# Altium schematic sheet Mecabot_schematic.SchDoc
size A3; SheetNumber: 1; SheetTotal: 1
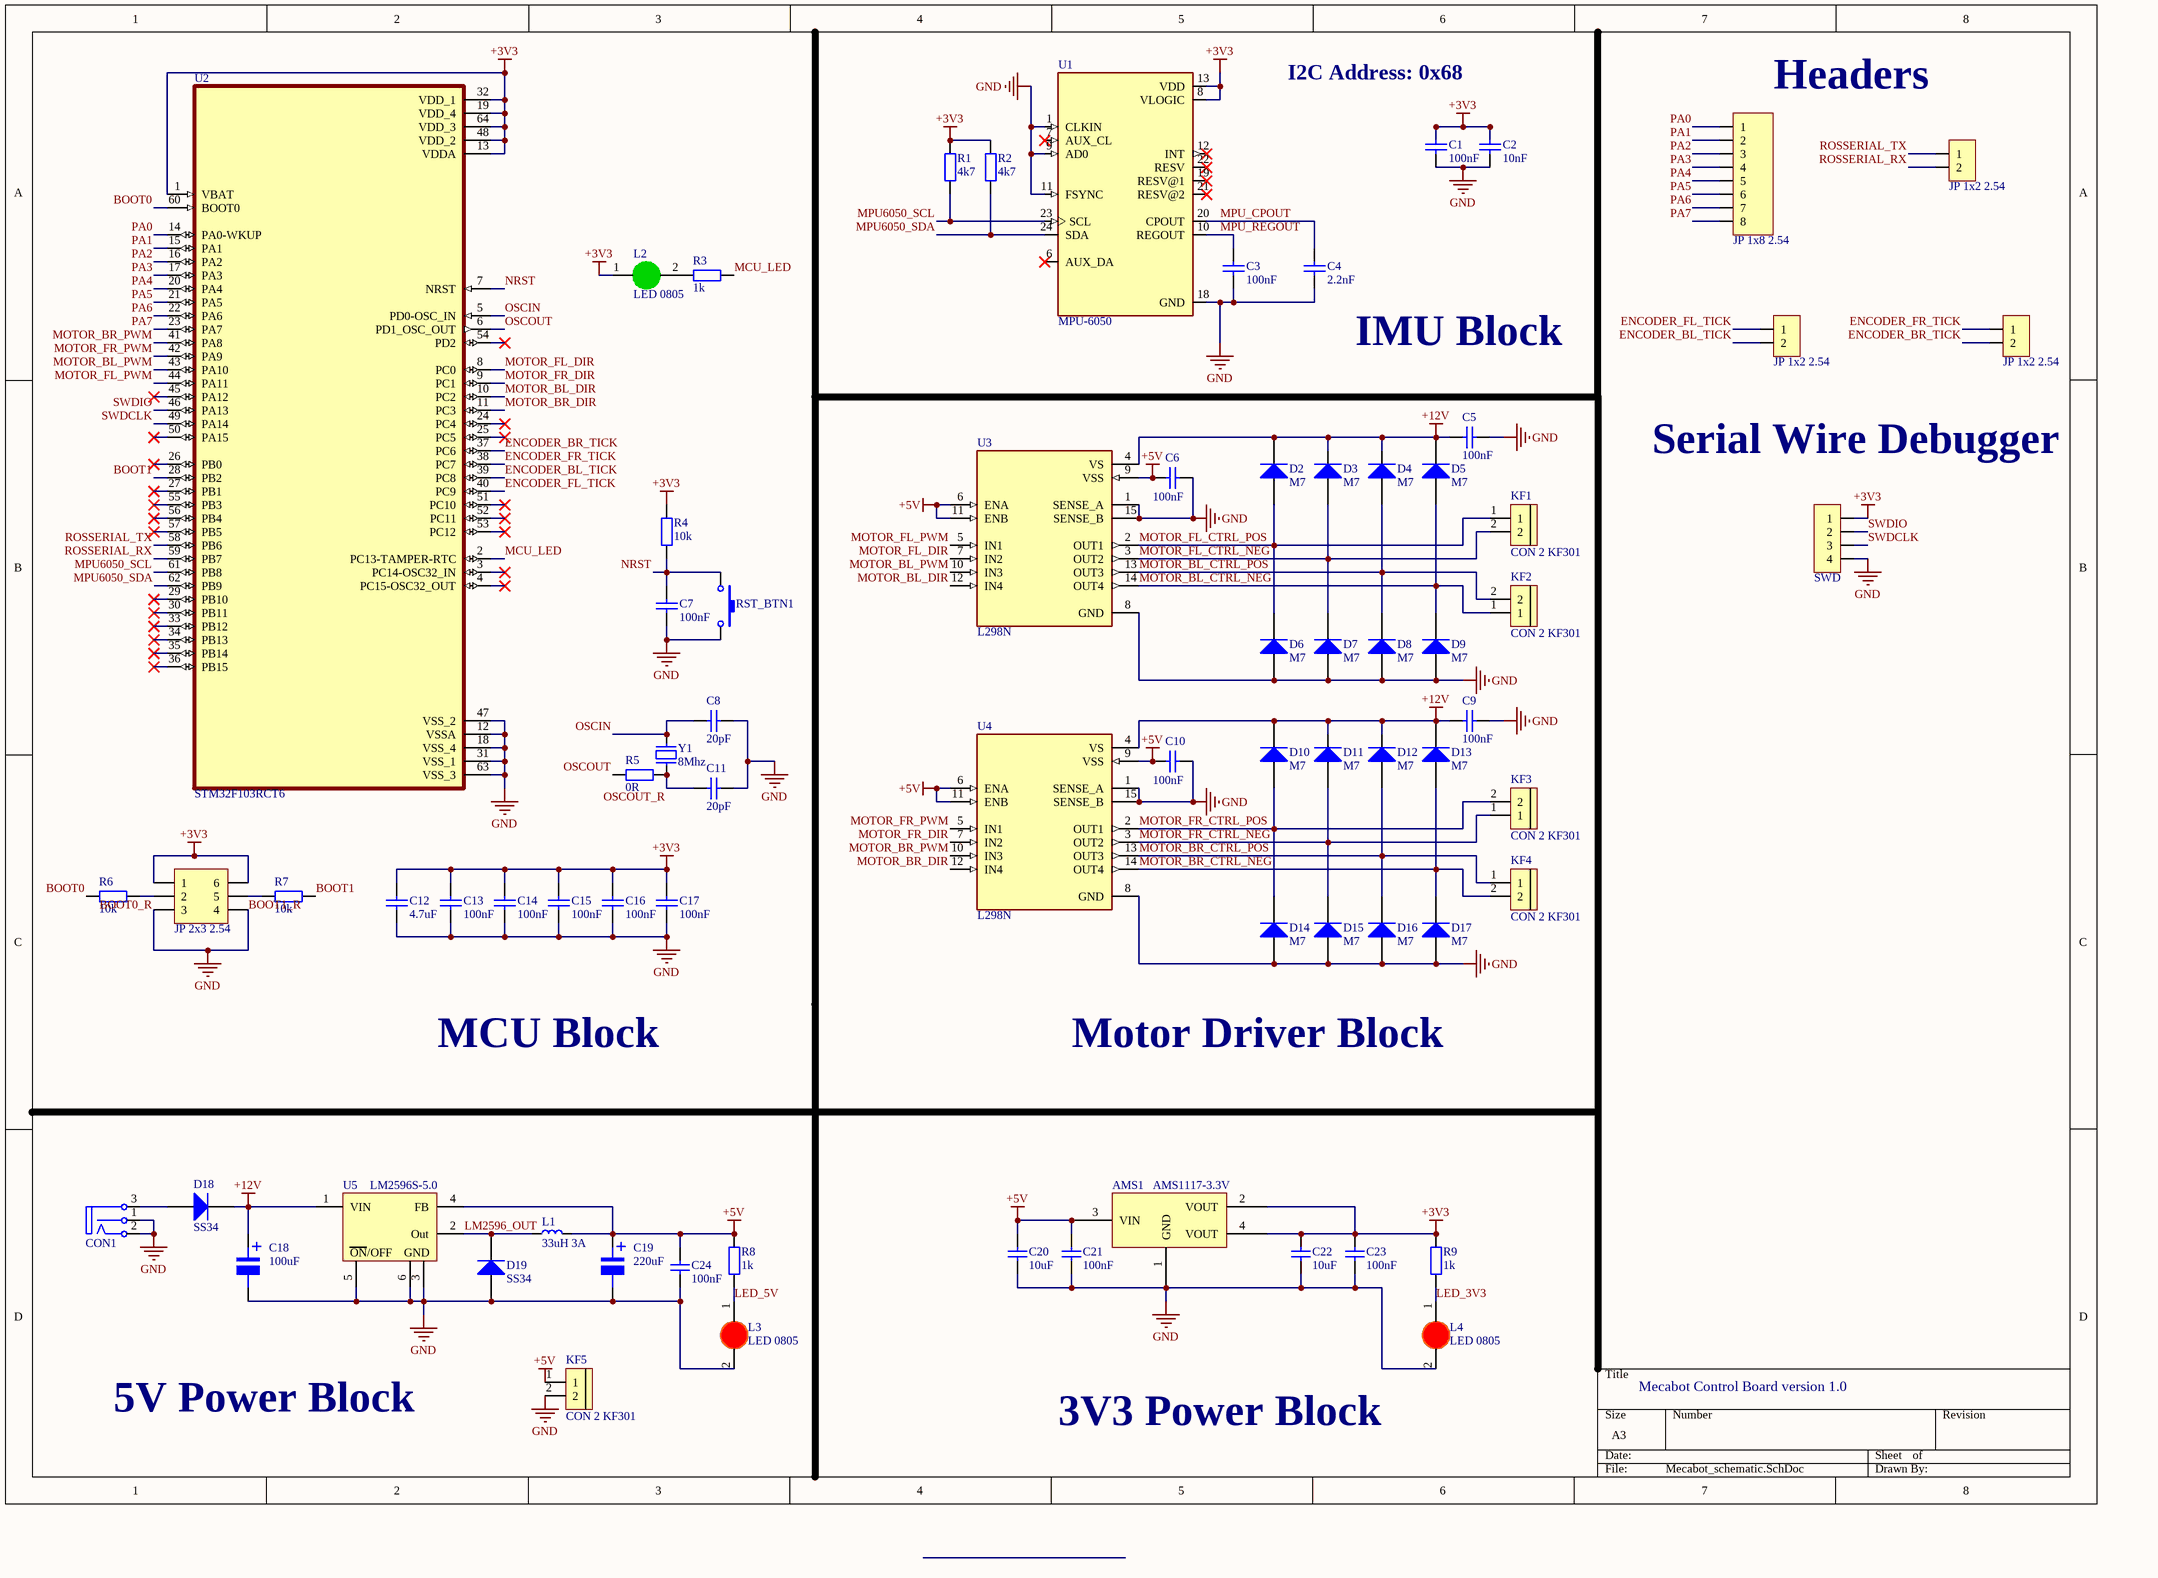
[diagram p0: Mecabot_schematic.SchDoc]

## Parts
AMS1  AMS1117-3.3V  [SOT223]
C1  100nF  [tu 0603]
C2  10nF  [tu 0603]
C3  100nF  [tu 0603]
C4  2.2nF  [tu 0603]
C5  100nF  [tu 0603]
C6  100nF  [tu 0603]
C7  100nF  [tu 0603]
C8  20pF  [tu 0603]
C9  100nF  [tu 0603]
C10  100nF  [tu 0603]
C11  20pF  [tu 0603]
C12  4.7uF  [tu 0805]
C13  100nF  [tu 0603]
C14  100nF  [tu 0603]
C15  100nF  [tu 0603]
C16  100nF  [tu 0603]
C17  100nF  [tu 0603]
C18  100uF  [tu nhom 8 (f)]
C19  220uF  [tu nhom 8 (f)]
C20  10uF  [C 0603]
C21  100nF  [C 0603]
C22  10uF  [C 0603]
C23  100nF  [C 0603]
C24  100nF  [C 0603]
CON1  CON DC PWR  [CONN/DC/PWR/5.0MM]  (value not drawn)
D2  M7  [DIODE SMA]
D3  M7  [DIODE SMA]
D4  M7  [DIODE SMA]
D5  M7  [DIODE SMA]
D6  M7  [DIODE SMA]
D7  M7  [DIODE SMA]
D8  M7  [DIODE SMA]
D9  M7  [DIODE SMA]
D10  M7  [DIODE SMA]
D11  M7  [DIODE SMA]
D12  M7  [DIODE SMA]
D13  M7  [DIODE SMA]
D14  M7  [DIODE SMA]
D15  M7  [DIODE SMA]
D16  M7  [DIODE SMA]
D17  M7  [DIODE SMA]
D18  SS34  [DIODE SMA]
D19  SS34  [DIODE SMA]
JP1  JP 1x8 2.54  [JP 1x8 CT]
JP2  JP 1x2 2.54  [JP 1x2 DC]
JP3  JP 1x2 2.54  [JP 1x2 DT]
JP4  JP 1x2 2.54  [JP 1x2 DT]
JP5  SWD  [JP 1x4 DC]
JP6  JP 2x3 2.54  [JP 2x3 DT]
KF1  CON 2 KF301  [Con 2 KF301 5.08]
KF2  CON 2 KF301  [Con 2 KF301 5.08]
KF3  CON 2 KF301  [Con 2 KF301 5.08]
KF4  CON 2 KF301  [Con 2 KF301 5.08]
KF5  CON 2 KF301  [Con 2 KF301 5.08]
L1  33uH 3A  [Inductor SMD 12x12x8]
L2  LED 0805  [LED-1206-Green]
L3  LED 0805  [LED-1206-Red]
L4  LED 0805  [LED-1206-Red]
R1  4k7  [tro smd 0603]
R2  4k7  [tro smd 0603]
R3  1k  [tro smd 0603]
R4  10k  [tro smd 0603]
R5  0R  [tro smd 0603]
R6  10k  [tro smd 0603]
R7  10k  [tro smd 0603]
R8  1k  [tro smd 0603]
R9  1k  [tro smd 0603]
RST_BTN1  Nut Nhan 2 Chan SMD 3x6x2.5  [Nut Nhan 2 Chan SMD 3x6x2.5]  (value not drawn)
U1  MPU-6050  [QFN50P400X400X95-24N]
U2  STM32F103RCT6  [QFP50P1200X1200X160-64N]
U3  L298N  [L298N]
U4  L298N  [L298N]
U5  LM2596S-5.0  [TO-263-5]
Y1  8Mhz  [Thach Anh 2 chan cam]

## Nets
+3V3: AMS1.2(VOUT) AMS1.4(VOUT) C1.1 C2.1 C12.1 C13.1 C14.1 C15.1 C16.1 C17.1 C22.1 C23.1 JP5.1 JP6.1 JP6.6 L2.1(A) R1.1 R2.1 R4.1 R9.2 U1.8(VLOGIC) U1.13(VDD) U2.1(VBAT) U2.13(VDDA) U2.19(VDD_4) U2.32(VDD_1) U2.48(VDD_2) U2.64(VDD_3)
+5V: AMS1.3(VIN) C6.1 C10.1 C19.1 C20.1 C21.1 C24.1 KF5.1 L1.2 R8.2 U3.6(ENA) U3.9(VSS) U3.11(ENB) U4.6(ENA) U4.9(VSS) U4.11(ENB) U5.4(FB)
+12V: C5.1 C9.1 C18.1 D2.2(K) D3.2(K) D4.2(K) D5.2(K) D10.2(K) D11.2(K) D12.2(K) D13.2(K) D18.2(K) U3.4(VS) U4.4(VS) U5.1(VIN)
GND: AMS1.1(GND) C1.2 C2.2 C3.2 C4.1 C5.2 C6.2 C7.2 C8.1 C9.2 C10.2 C11.1 C12.2 C13.2 C14.2 C15.2 C16.2 C17.2 C18.2 C19.2 C20.2 C21.2 C22.2 C23.2 C24.2 CON1.1(S) CON1.2(T) D6.1(A) D7.1(A) D8.1(A) D9.1(A) D14.1(A) D15.1(A) D16.1(A) D17.1(A) D19.1(A) JP5.4 JP6.3 JP6.4 KF5.2 L3.2(K) L4.2(K) RST_BTN1.2 U1.1(CLKIN) U1.9(AD0) U1.11(FSYNC) U1.18(GND) U2.12(VSSA) U2.18(VSS_4) U2.31(VSS_1) U2.47(VSS_2) U2.63(VSS_3) U3.1(SENSE_A) U3.8(GND) U3.15(SENSE_B) U4.1(SENSE_A) U4.8(GND) U4.15(SENSE_B) U5.3(GND) U5.5(~{ON}/OFF) U5.6(PAD)
BOOT0: R6.2 U2.60(BOOT0)
BOOT0_R: JP6.2 R6.1
BOOT1: R7.1 U2.28(PB2)
BOOT1_R: JP6.5 R7.2
ENCODER_BL_TICK: JP3.2 U2.39(PC8)
ENCODER_BR_TICK: JP4.2 U2.37(PC6)
ENCODER_FL_TICK: JP3.1 U2.40(PC9)
ENCODER_FR_TICK: JP4.1 U2.38(PC7)
LED_3V3: L4.1(A) R9.1
LED_5V: L3.1(A) R8.1
LM2596_OUT: D19.2(K) L1.1 U5.2(Out)
MCU_LED: R3.1 U2.2(PC13-TAMPER-RTC)
MOTOR_BL_CTRL_NEG: D5.1(A) D9.2(K) KF2.1 U3.14(OUT4)
MOTOR_BL_CTRL_POS: D4.1(A) D8.2(K) KF2.2 U3.13(OUT3)
MOTOR_BL_DIR: U2.10(PC2) U3.12(IN4)
MOTOR_BL_PWM: U2.43(PA10) U3.10(IN3)
MOTOR_BR_CTRL_NEG: D13.1(A) D17.2(K) KF4.2 U4.14(OUT4)
MOTOR_BR_CTRL_POS: D12.1(A) D16.2(K) KF4.1 U4.13(OUT3)
MOTOR_BR_DIR: U2.11(PC3) U4.12(IN4)
MOTOR_BR_PWM: U2.41(PA8) U4.10(IN3)
MOTOR_FL_CTRL_NEG: D3.1(A) D7.2(K) KF1.2 U3.3(OUT2)
MOTOR_FL_CTRL_POS: D2.1(A) D6.2(K) KF1.1 U3.2(OUT1)
MOTOR_FL_DIR: U2.8(PC0) U3.7(IN2)
MOTOR_FL_PWM: U2.44(PA11) U3.5(IN1)
MOTOR_FR_CTRL_NEG: D11.1(A) D15.2(K) KF3.1 U4.3(OUT2)
MOTOR_FR_CTRL_POS: D10.1(A) D14.2(K) KF3.2 U4.2(OUT1)
MOTOR_FR_DIR: U2.9(PC1) U4.7(IN2)
MOTOR_FR_PWM: U2.42(PA9) U4.5(IN1)
MPU6050_SCL: R1.2 U1.23(SCL) U2.61(PB8)
MPU6050_SDA: R2.2 U1.24(SDA) U2.62(PB9)
MPU_CPOUT: C4.2 U1.20(CPOUT)
MPU_REGOUT: C3.1 U1.10(REGOUT)
NRST: C7.1 R4.2 RST_BTN1.1 U2.7(NRST)
OSCIN: C8.2 U2.5(PD0-OSC_IN) Y1.1
OSCOUT: R5.2 U2.6(PD1_OSC_OUT)
OSCOUT_R: C11.2 R5.1 Y1.2
PA0: JP1.1 U2.14(PA0-WKUP)
PA1: JP1.2 U2.15(PA1)
PA2: JP1.3 U2.16(PA2)
PA3: JP1.4 U2.17(PA3)
PA4: JP1.5 U2.20(PA4)
PA5: JP1.6 U2.21(PA5)
PA6: JP1.7 U2.22(PA6)
PA7: JP1.8 U2.23(PA7)
ROSSERIAL_RX: JP2.2 U2.59(PB7)
ROSSERIAL_TX: JP2.1 U2.58(PB6)
SWDCLK: JP5.3 U2.49(PA14)
SWDIO: JP5.2 U2.46(PA13)
NetCON1_3: CON1.3(TN) D18.1(A)
NetL2_2: L2.2(K) R3.2

Not connected (* = marked no-connect by the designer): U1 6(AUX_DA)* 7(AUX_CL)* 12(INT)* 19(RESV@1)* 21(RESV@2)* 22(RESV)*; U2 3(PC14-OSC32_IN)* 4(PC15-OSC32_OUT)* 24(PC4)* 25(PC5)* 26(PB0)* 27(PB1)* 29(PB10)* 30(PB11)* 33(PB12)* 34(PB13)* 35(PB14)* 36(PB15)* 45(PA12)* 50(PA15)* 51(PC10)* 52(PC11)* 53(PC12)* 54(PD2)* 55(PB3)* 56(PB4)* 57(PB5)*

## Notes on the sheet
- I2C Address: 0x68
- Headers
- IMU Block
- Serial Wire Debugger
- MCU Block
- Motor Driver Block
- Mecabot Control Board version 1.0
- 5V Power Block
- 3V3 Power Block
- (in symbol LM2596S-5.0) ON/OFF
- (in symbol Tu Nhom 100uF 50V) +
- (in symbol Tu Nhom 220uF 25V) +

## Library data of the parts
AMS1 = AMS1117 SMD: Dán; Value: AMS1117-3.3V SOT223; Don_Vi: Con; Ma_Hang: MH000596; Ghi_Chu: *; Kieu_Chan: *; Chung_Loai: Dán
C1 C3 C5-C11 C13-C17 = Tu 0603 104 50V 10%: Dán; Don_Vi: Con; So_Chan: 2; Ten_Linh_Kien: Tụ 0603 104-100nF 10% 50V; Ma_Hang: MH004568; Chung_Loai: Dán; Kieu_Chan: *
C2 = Tu 0603 103 50V 10%: Dán; Don_Vi: Con; So_Chan: 2; Ten_Linh_Kien: Tụ 0603 103-10nF 10% 50V; Ma_Hang: MH004567; Chung_Loai: Dán; Kieu_Chan: *
C4 = Tu 0603 22pF 50V 10%: Dán; Don_Vi: Con; So_Chan: 2; Ten_Linh_Kien: Tụ 0603 22pF 50V 10%; Ma_Hang: MH004570; Chung_Loai: Dán; Kieu_Chan: *
C12 = Tu 0805 475 25V 20%: Dán; Don_Vi: Con; So_Chan: 2; Ten_Linh_Kien: Tụ 0805 475-4.7uF 20% 25V; Ma_Hang: MH004276; Chung_Loai: Dán; Kieu_Chan: *
C18 = Tu Nhom 100uF 50V: Dán; Don_Vi: Con; So_Chan: 2; Ten_Linh_Kien: Tụ Nhôm 100uF 50V 8x10.2MM; Ma_Hang: MH002223; Chung_Loai: Dán; Kieu_Chan: *
C19 = Tu Nhom 220uF 25V: Dán; Don_Vi: Con; So_Chan: 2; Ten_Linh_Kien: Tụ Nhôm 220uF 25V; Ma_Hang: MH002221; Chung_Loai: Dán; Kieu_Chan: *
C20-C24 = Capacitor NP: Capacitor non-pol
CON1 = CON DC PWR: DC input connector
D2-D17 = Diode M7 ( 4007 ): Dán; Don_Vi: Con; Ten_Linh_Kien: Diode M7 1N4007 SMD 1A 1000V; Ma_Hang: MH000944; Chung_Loai: Dán; Ghi_Chu: *
D18 D19 = Diode SS34 ( 1N5822 ): Dán; Don_Vi: Con; Ma_Hang: MH002104; Ten_Linh_Kien: Diode SS34 3A 40V SMA ( 1N5822 SS34A); Kieu_Chan: *; Chung_Loai: Dán
JP1 = JP 1x8 2.54 Cai Thang: Cắm; Ten_Linh_Kien: Jump Đơn Cái 2.54MM 1x20P Thẳng; Don_Vi: Con; Ma_Hang: MH004006; Ghi_Chu: *; Kieu_Chan: *; Chung_Loai: Cắm
JP2 = JP 1x2 2.54 Duc Cong: Cắm; Ten_Linh_Kien: Jump Đơn Đực 2.54MM 1x40P Cong Đứng; Don_Vi: Con; Ma_Hang: MH000904; Ghi_Chu: *; Kieu_Chan: *; Chung_Loai: Cắm
JP3 JP4 = JP 1x2 2.54 Duc Thang: Cắm; Ten_Linh_Kien: Jump Đơn Đực 2.54MM 1x40P Thẳng 11MM; Don_Vi: Con; Ma_Hang: MH000903; Ghi_Chu: *; Kieu_Chan: *; Chung_Loai: Cắm
JP5 = JP 1x4 2.54 Duc Cong: Cắm; Ten_Linh_Kien: Jump Đơn Đực 2.54MM 1x40P Cong Đứng; Don_Vi: Con; Ma_Hang: MH000904; Ghi_Chu: *; Kieu_Chan: *; Chung_Loai: Cắm
JP6 = JP 2x3 2.54 Duc Thang: Cắm; Ten_Linh_Kien: Jump Đôi Đực 2.54MM 2x40P Thẳng 11MM; Don_Vi: Con; Ma_Hang: MH002686; Ghi_Chu: *; Kieu_Chan: *; Chung_Loai: Cắm
KF1-KF5 = CON 2 KF301: Cắm; Ma_Hang: MH000987; Ten_Linh_Kien: CON 2 KF301-2P 5.08MM Xanh Dương; Chung_Loai: Cắm; Ghi_Chu: *; Kieu_Chan: *; Don_Vi: Con
L1 = Inductor
L2 = LED 1206 Xanh La: Dán; Don_Vi: Con; Ma_Hang: MH002947; Ten_Linh_Kien: LED1206 Màu Xanh Lá (Green); Ghi_Chu: *; Kieu_Chan: *; Chung_Loai: Dán
L3 L4 = LED 1206 Do: Dán; Don_Vi: Con; Ma_Hang: MH002334; Ten_Linh_Kien: LED1206 Màu Đỏ (Red); Ghi_Chu: *; Kieu_Chan: *; Chung_Loai: Dán
R1-R9 = Tro 0603 1% 0R: Dán; Don_Vi: Con; So_Chan: 2; Ten_Linh_Kien: Trở 0603 1% 0R; Ma_Hang: MH005792; Chung_Loai: Dán; Kieu_Chan: *
RST_BTN1 = Nut Nhan 2 Chan SMD 3x6x2.5: Ma_Hang: MH001036; Ten: Nút Nhấn 2 Chân 3x6x2.5MM SMD
U1 = MPU-6050: MPU-6050 series Accelerometer, Gyroscope, 3 Axis Sensor Evaluation Board; MF: TDK InvenSense; Value: *; SnapEDA_Link: https://www.snapeda.com/parts/MPU-6050/TDK+InvenSense/view-part/?ref=snap; Purchase-URL: https://pricing.snapeda.com/search/part/MPU-6050/?ref=eda; Availability: In Stock; Price: None; Package: QFN-24 InvenSense; Check_prices: https://www.snapeda.com/parts/MPU-6050/TDK+InvenSense/view-part/?ref=eda; MP: MPU-6050
U2 = STM32F103RCT6: ARMÂ® CortexÂ®-M3 STM32F1 Microcontroller IC 32-Bit 72MHz 256KB (256K x 8) FLASH 64-LQFP (10x10); MF: STMicroelectronics; Value: *; SnapEDA_Link: https://www.snapeda.com/parts/STM32F103RCT6/STMicroelectronics/view-part/?ref=snap; MP: STM32F103RCT6; Purchase-URL: https://pricing.snapeda.com/search/part/STM32F103RCT6/?ref=eda; Check_prices: https://www.snapeda.com/parts/STM32F103RCT6/STMicroelectronics/view-part/?ref=eda; Availability: In Stock; Price: None; Package: LQFP-64 STMicroelectronics
U3 U4 = L298N: Half Bridge _4_ Driver DC Motors, Relays, Solenoids, Stepper Motors Bipolar 15-Multiwatt; MF: STMicroelectronics; MP: L298N; Package: Multiwatt-15 STMicroelectronics; Price: None; Availability: Unavailable; Value: *; SnapEDA_Link: https://www.snapeda.com/parts/L298N/STMicroelectronics/view-part/294022/?ref=snap
U5 = LM2596S-5.0: Simple Switcher 3A Step-Down Voltage Regulator
Y1 = Thach Anh 2 chan Cam: Crystal For all Crystal 2pin.; Value: 4Mhz